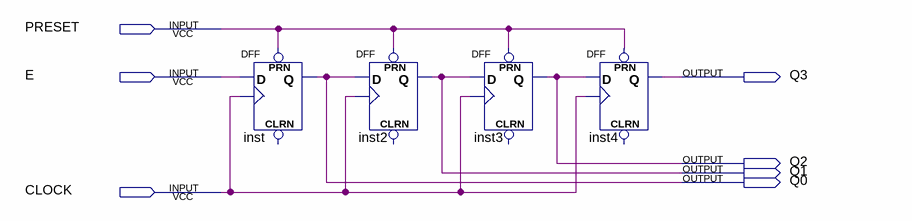
[diagram p0: schematic sheet]
// Quartus schematic shift_register.bdf as structural Verilog: 4 symbols, 7 pins
module shift_register (
  input  PRESET,
  input  E,
  input  CLOCK,
  output Q3,
  output Q2,
  output Q1,
  output Q0
);

  DFF inst (.CLK(CLOCK), .D(E), .PRN(PRESET), .Q(Q0));  // open: CLRN
  DFF inst2 (.CLK(CLOCK), .D(Q0), .PRN(PRESET), .Q(Q1));  // open: CLRN
  DFF inst3 (.CLK(CLOCK), .D(Q1), .PRN(PRESET), .Q(Q2));  // open: CLRN
  DFF inst4 (.CLK(CLOCK), .D(Q2), .PRN(PRESET), .Q(Q3));  // open: CLRN
endmodule
